# Altium schematic sheet LaserTagTargetBoard.SchDoc
size A; SheetNumber: 2; SheetTotal: 2
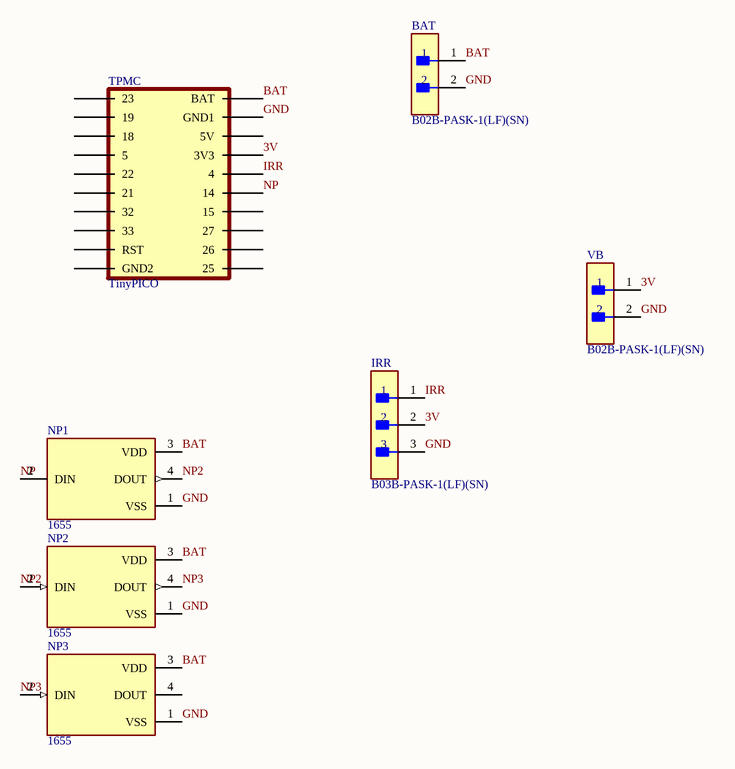
[diagram p0: LaserTagTargetBoard.SchDoc]

## Parts
BAT  B02B-PASK-1(LF)(SN)  [FP-B02B-PASK-1_LF_SN-MFG]
IRR  B03B-PASK-1(LF)(SN)  [FP-B03B-PASK-1_LF_SN-MFG]
NP1  1655  [LED_1655]
NP2  1655  [LED_1655]
NP3  1655  [LED_1655]
TPMC  TinyPICO  [TinyPICO]
VB  B02B-PASK-1(LF)(SN)  [FP-B02B-PASK-1_LF_SN-MFG]

## Nets
3V: IRR.2 TPMC.3V3 VB.1
BAT: BAT.1 NP1.3(VDD) NP2.3(VDD) NP3.3(VDD) TPMC.BAT
GND: BAT.2 IRR.3 NP1.1(VSS) NP2.1(VSS) NP3.1(VSS) TPMC.GND1 VB.2
IRR: IRR.1 TPMC.4
NP: NP1.2(DIN) TPMC.14
NP2: NP1.4(DOUT) NP2.2(DIN)
NP3: NP2.4(DOUT) NP3.2(DIN)

Not connected (* = marked no-connect by the designer): NP3 4(DOUT); TPMC 5 5V 15 18 19 21 22 23 25 26 27 32 33 GND2 RST

## Library data of the parts
BAT VB = CMP-17439-000415-1: CONN HEADER VERT 2POS 2MM; Number of Contacts: 2; Current Rating: 3A; Insulation Resistance: 1GR; Mated Stacking Heights: 14.9mm; Voltage Rating: 250V; Gender: Male; Pitch: 2mm; Orientation: Straight; Contact Finish - Mating: TIN; Mount: Through Hole; Contact Type: Male Pin; Number of Rows: 1; Fastening Type: Ramp; Series: PA; Connector Type: Header; Insulation Color: Natural; Flammability Rating: UL94 V-0; Material: Polybutylene; Contact Shape: Square; Contact Plating: Tin; Insulation Material: PBT; Max Operating Temperature: 85°C; Housing Color: White; Number of Positions: 2; Contact Material: Copper Alloy; Min Operating Temperature: -25°C; Lead Free: Lead Free; Contact Mating Length: 0.126inch; Termination: Solder; Packaging: Bulk; Color: Natural
IRR = CMP-17439-000193-1: CONN HEADER VERT 3POS 2MM; Voltage Rating: 250V; Current Rating: 3A; Mated Stacking Heights: 14.9mm; Number of Positions: 3; Packaging: Bulk; Contact Type: Male Pin; Flammability Rating: UL94 V-0; Contact Shape: Square; Number of Rows: 1; Color: Natural; Orientation: Straight; Housing Color: White; Fastening Type: Ramp; Insulation Material: PBT; Insulation Color: Natural; Mount: Through Hole; Contact Finish - Mating: TIN; Connector Type: Header; Termination: Solder; Contact Mating Length: 0.126inch; Lead Free: Lead Free; Contact Material: Copper Alloy; Pitch: 2mm; Series: PA; Number of Contacts: 3; Contact Plating: Tin
NP1-NP3 = 1655: Ws2812b 5050 Rgb Led With Integrated Driver Chip Pack Of 10; Package: None; MP: 1655; Price: None; Availability: Unavailable; Value: *